# Altium project camera_module_V1R1.PrjPcb (part 1 of 2)
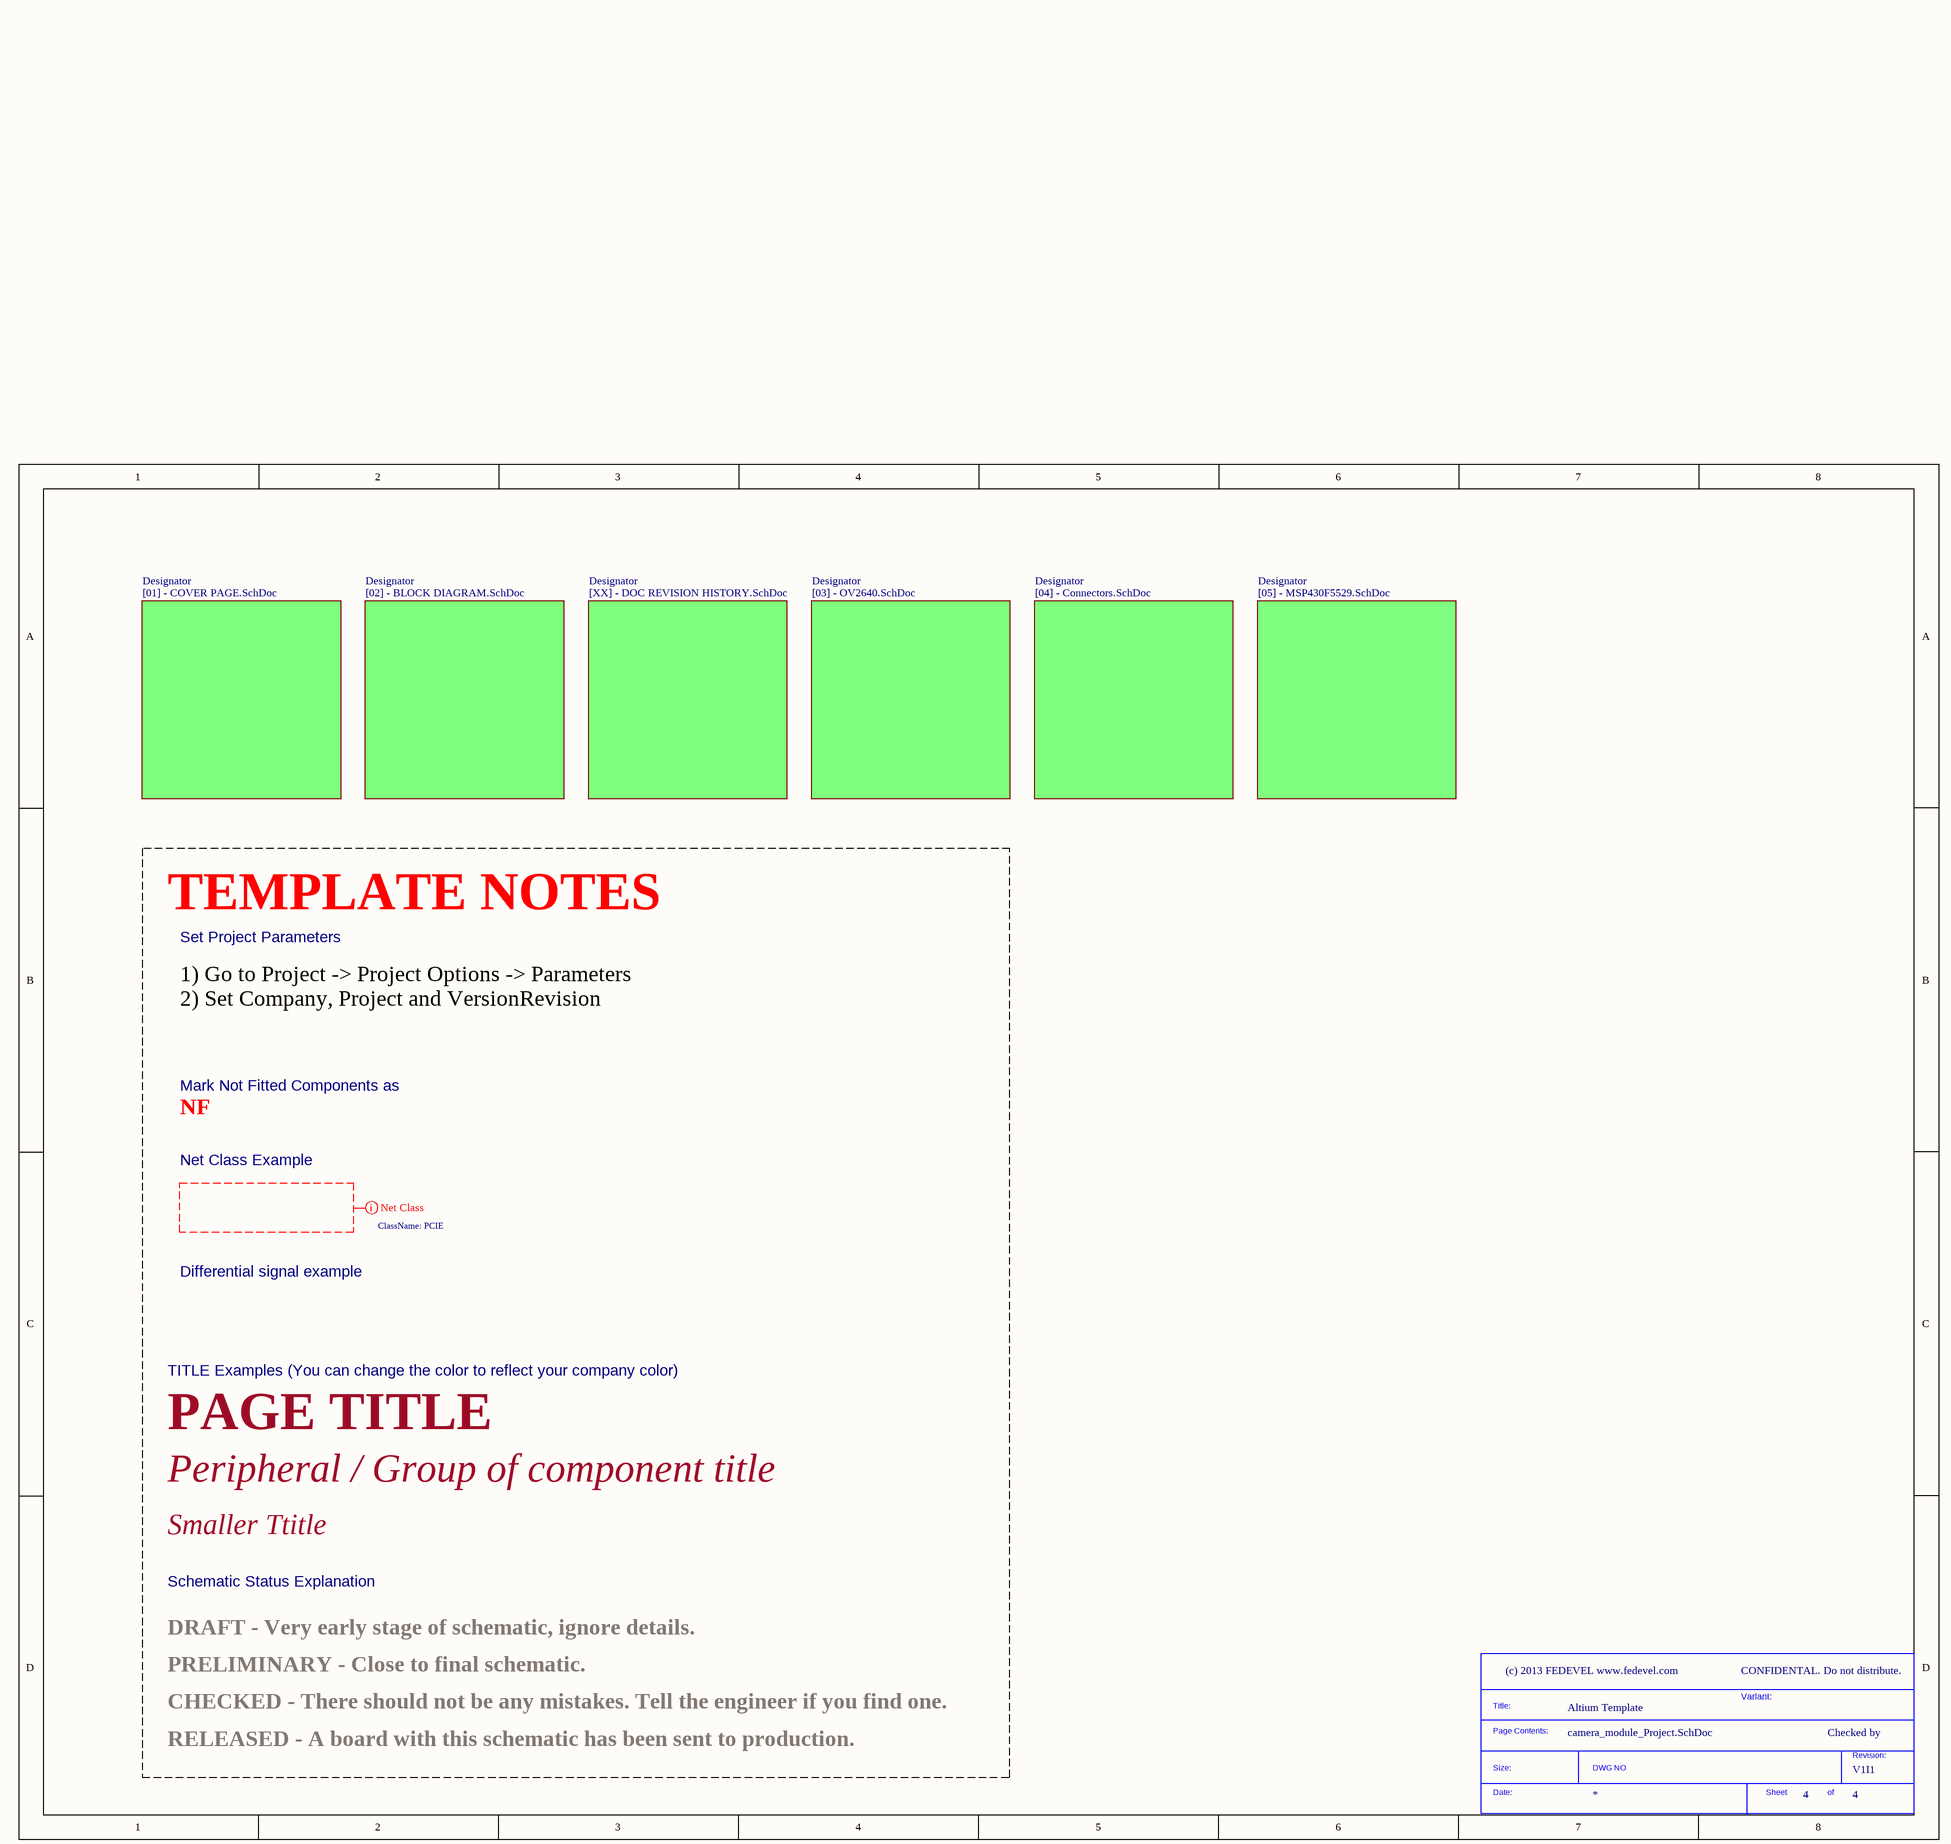
[diagram p0: camera_module_Project.SchDoc]
Company: (c) 2013 FEDEVEL www.fedevel.com; Project: Altium Template; VersionRevision: V1I1
5 sheets, 124 parts. Net scope: flat (ports and power ports of the same name join across sheets).
Board file: camera_module_PCB_V1R1.PcbDoc
Sheets:
  camera_module_Project.SchDoc
    Designator = [01] - COVER PAGE.SchDoc
    Designator = [03] - OV2640.SchDoc
    Designator = [04] - Connectors.SchDoc
    Designator = [05] - MSP430F5529.SchDoc

## Sheet camera_module_Project.SchDoc
size A3; CompanyName: KDS; Organization: KDS; DocumentNumber: 4; Revision: V1I1; SheetNumber: 4; SheetTotal: 4; PageSetup: Record=PageOptions|CenterHorizontal=True|CenterVertical=True|PrintScale=1.07|XCorrection=1.00|YCorrection=1.00|PrintKind=1|BorderSize=5000000|LeftOffset=0|BottomOffset=0|Orientation=2|PaperLength=1000|PaperWidth=1000|Scale=100|PaperSource=7|PrintQuality=600|MediaType=1|DitherType=10|PaperKind=A3|PrintScaleMode=1; ProjectName: KDS C6A816x Module

### Parts
(Parts that share a designator on the sheet are numbered #1, #2 ... from top to bottom, then left to right.)
*#1  SDTitleBlock  (value not drawn)  (graphical)

### Sub-sheets
Designator = [01] - COVER PAGE.SchDoc: no entries
Designator = [02] - BLOCK DIAGRAM.SchDoc (file not in this document): no entries
Designator = [XX] - DOC REVISION HISTORY.SchDoc (file not in this document): no entries
Designator = [03] - OV2640.SchDoc: no entries
Designator = [04] - Connectors.SchDoc: no entries
Designator = [05] - MSP430F5529.SchDoc: no entries

### Layout directives
net class PCIE: (no net found under the mark)

### Notes on the sheet
- TEMPLATE NOTES
- Set Project Parameters
- 1) Go to Project -> Project Options -> Parameters
  2) Set Company, Project and VersionRevision
- NF
- Mark Not Fitted Components as
- Net Class Example
- Differential signal example
- TITLE Examples (You can change the color to reflect your company color)
- PAGE TITLE
- Peripheral / Group of component title
- Smaller Ttitle
- Schematic Status Explanation
- PRELIMINARY - Close to final schematic.
- DRAFT - Very early stage of schematic, ignore details.
- CONFIDENTAL. Do not distribute.
- CHECKED - There should not be any mistakes. Tell the engineer if you find one.
- Variant:
- Checked by
- RELEASED - A board with this schematic has been sent to production.
- (in symbol SDTitleBlock) Title:; Page Contents:; Revision:; Size:; DWG NO; Date:; Sheet; of

## Sheet [01] - COVER PAGE.SchDoc
size A3; DocumentNumber: 1; SheetNumber: 1; SheetTotal: 4
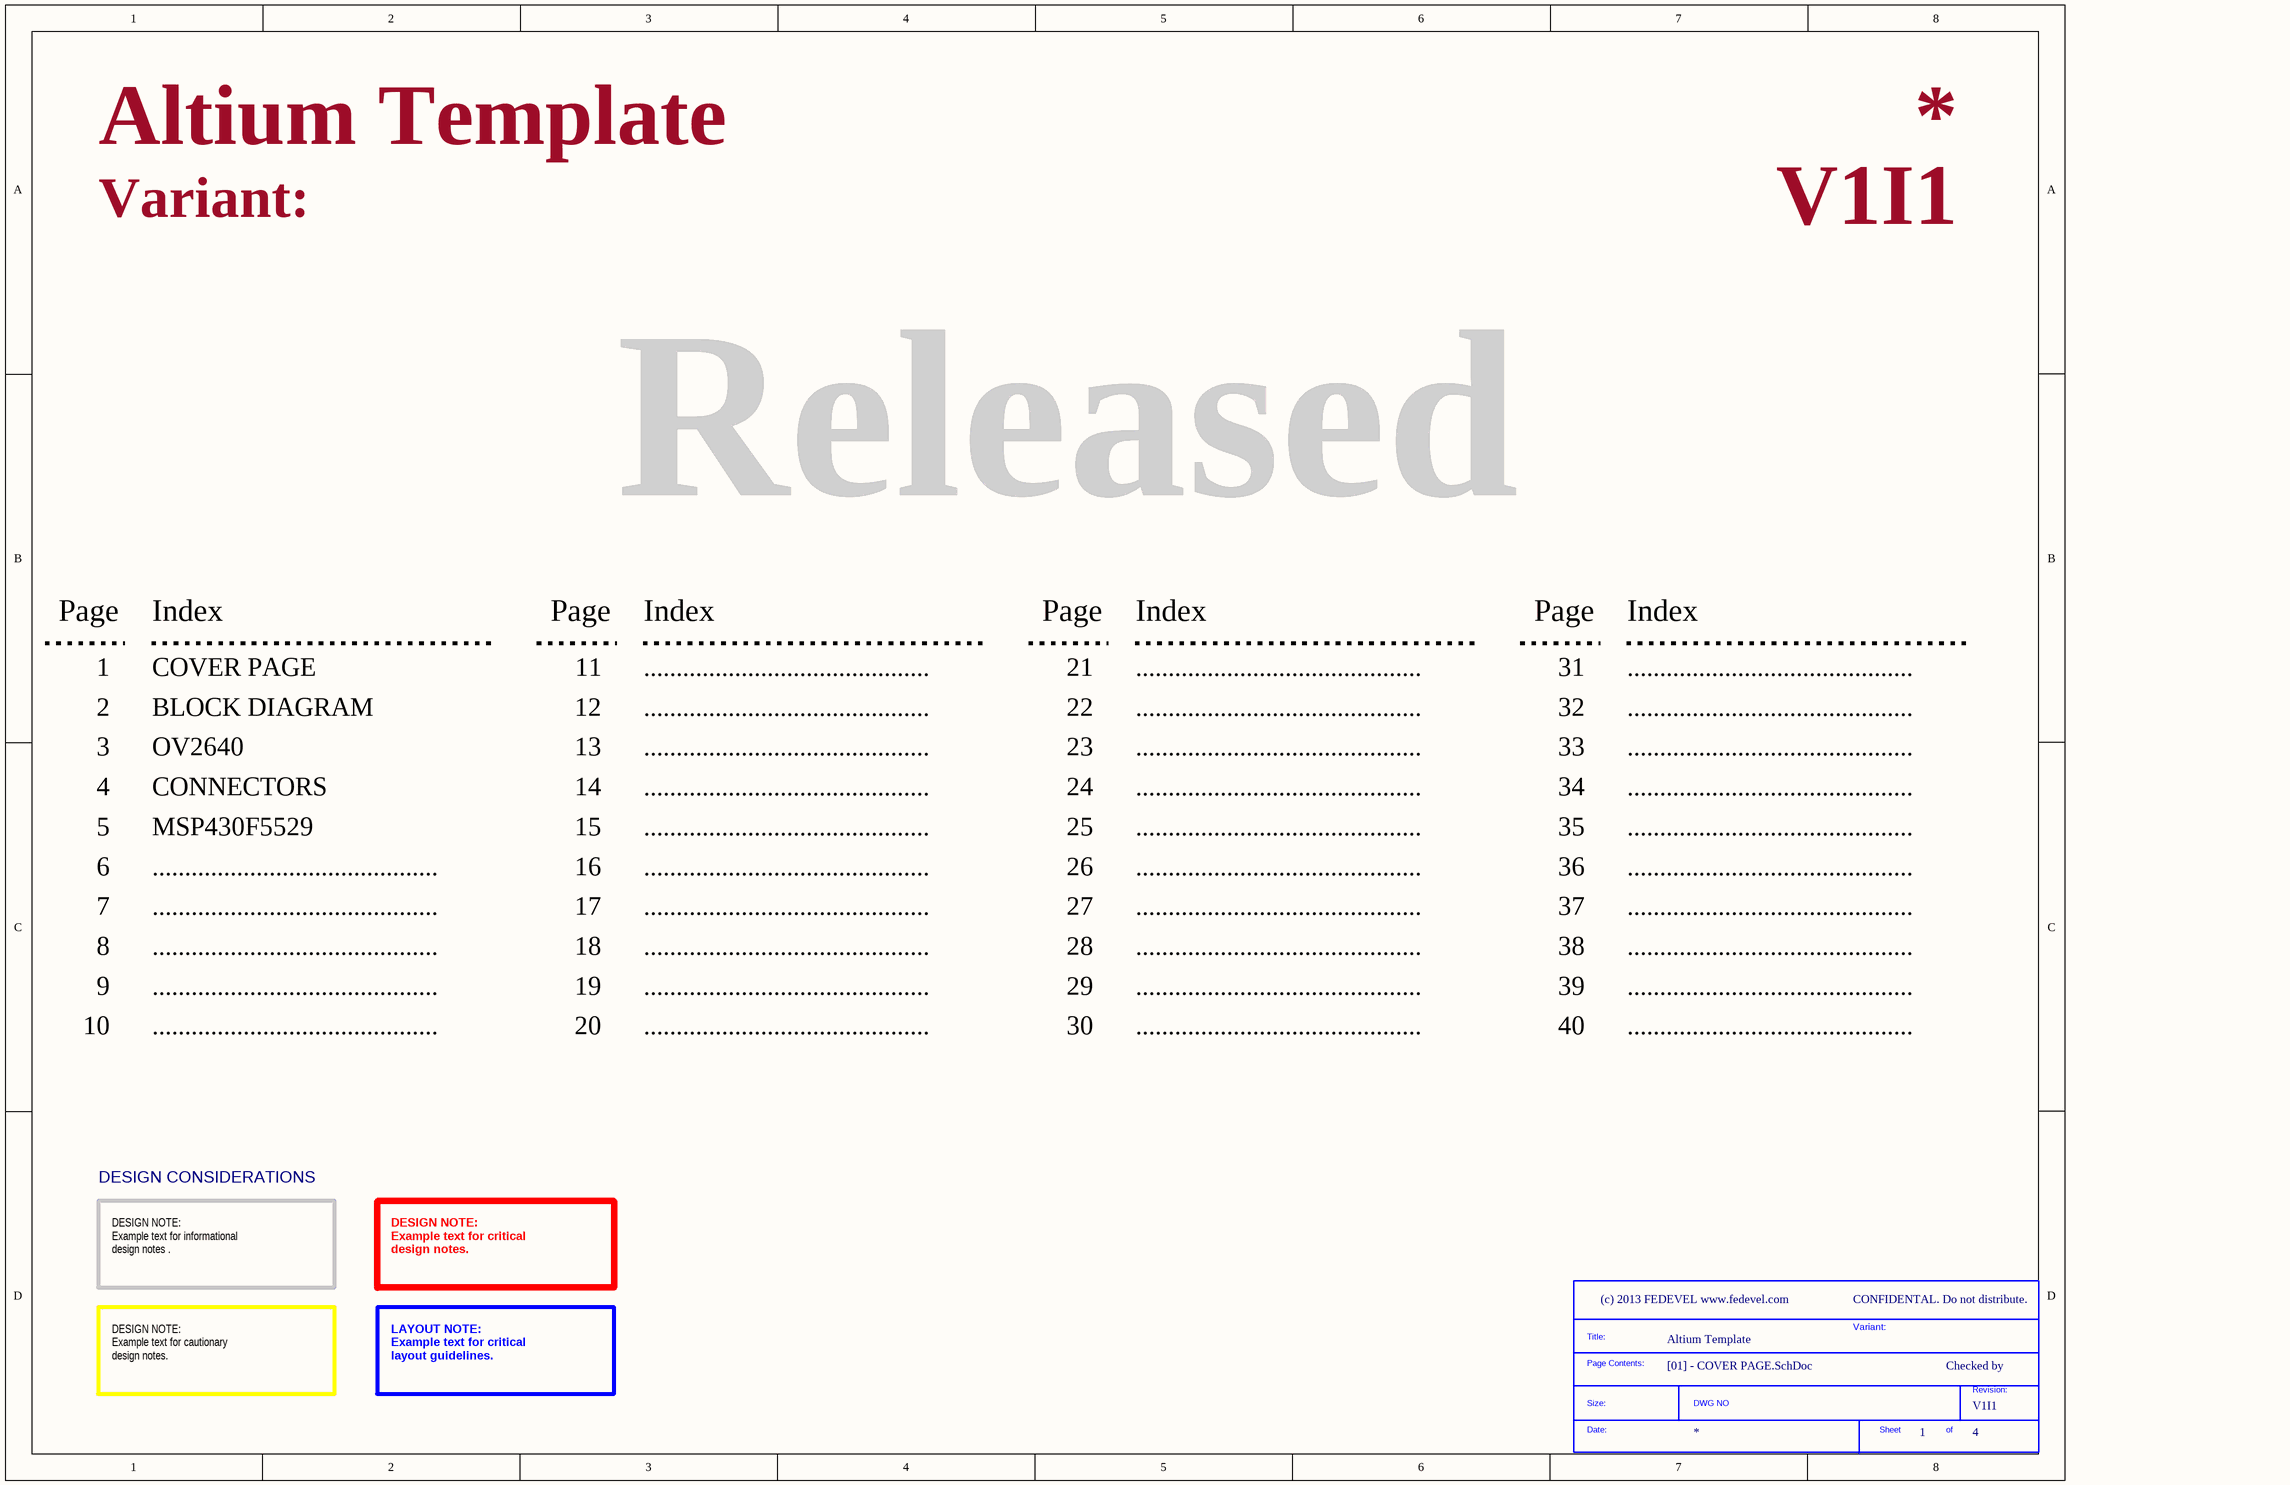
[diagram p1: [01] - COVER PAGE.SchDoc]

### Parts
(Parts that share a designator on the sheet are numbered #1, #2 ... from top to bottom, then left to right.)
*#2  SDTitleBlock  (value not drawn)  (graphical)

### Notes on the sheet
- Variant:
- Released
- Page
- Index
- 1
- COVER PAGE
- 11
- ............................................
- 21
- 31
- 2
- 3
- BLOCK DIAGRAM
- OV2640
- 12
- 13
- 22
- 23
- 32
- 33
- 4
- 5
- CONNECTORS
- MSP430F5529
- 14
- 15
- 24
- 25
- 34
- 35
- 6
- 16
- 26
- 36
- 7
- 8
- 17
- 18
- 27
- 28
- 37
- 38
- 9
- 10
- 19
- 20
- 29
- 30
- 39
- 40
- DESIGN CONSIDERATIONS
- DESIGN NOTE:
  Example text for informational
  design notes .
- DESIGN NOTE:
  Example text for critical
  design notes.
- CONFIDENTAL. Do not distribute.
- Checked by
- DESIGN NOTE:
  Example text for cautionary
  design notes.
- LAYOUT NOTE:
  Example text for critical
  layout guidelines.
- (in symbol SDTitleBlock) Title:; Page Contents:; Revision:; Size:; DWG NO; Date:; Sheet; of

## Sheet [03] - OV2640.SchDoc
size A3; DocumentNumber: 2; SheetNumber: 2; SheetTotal: 4
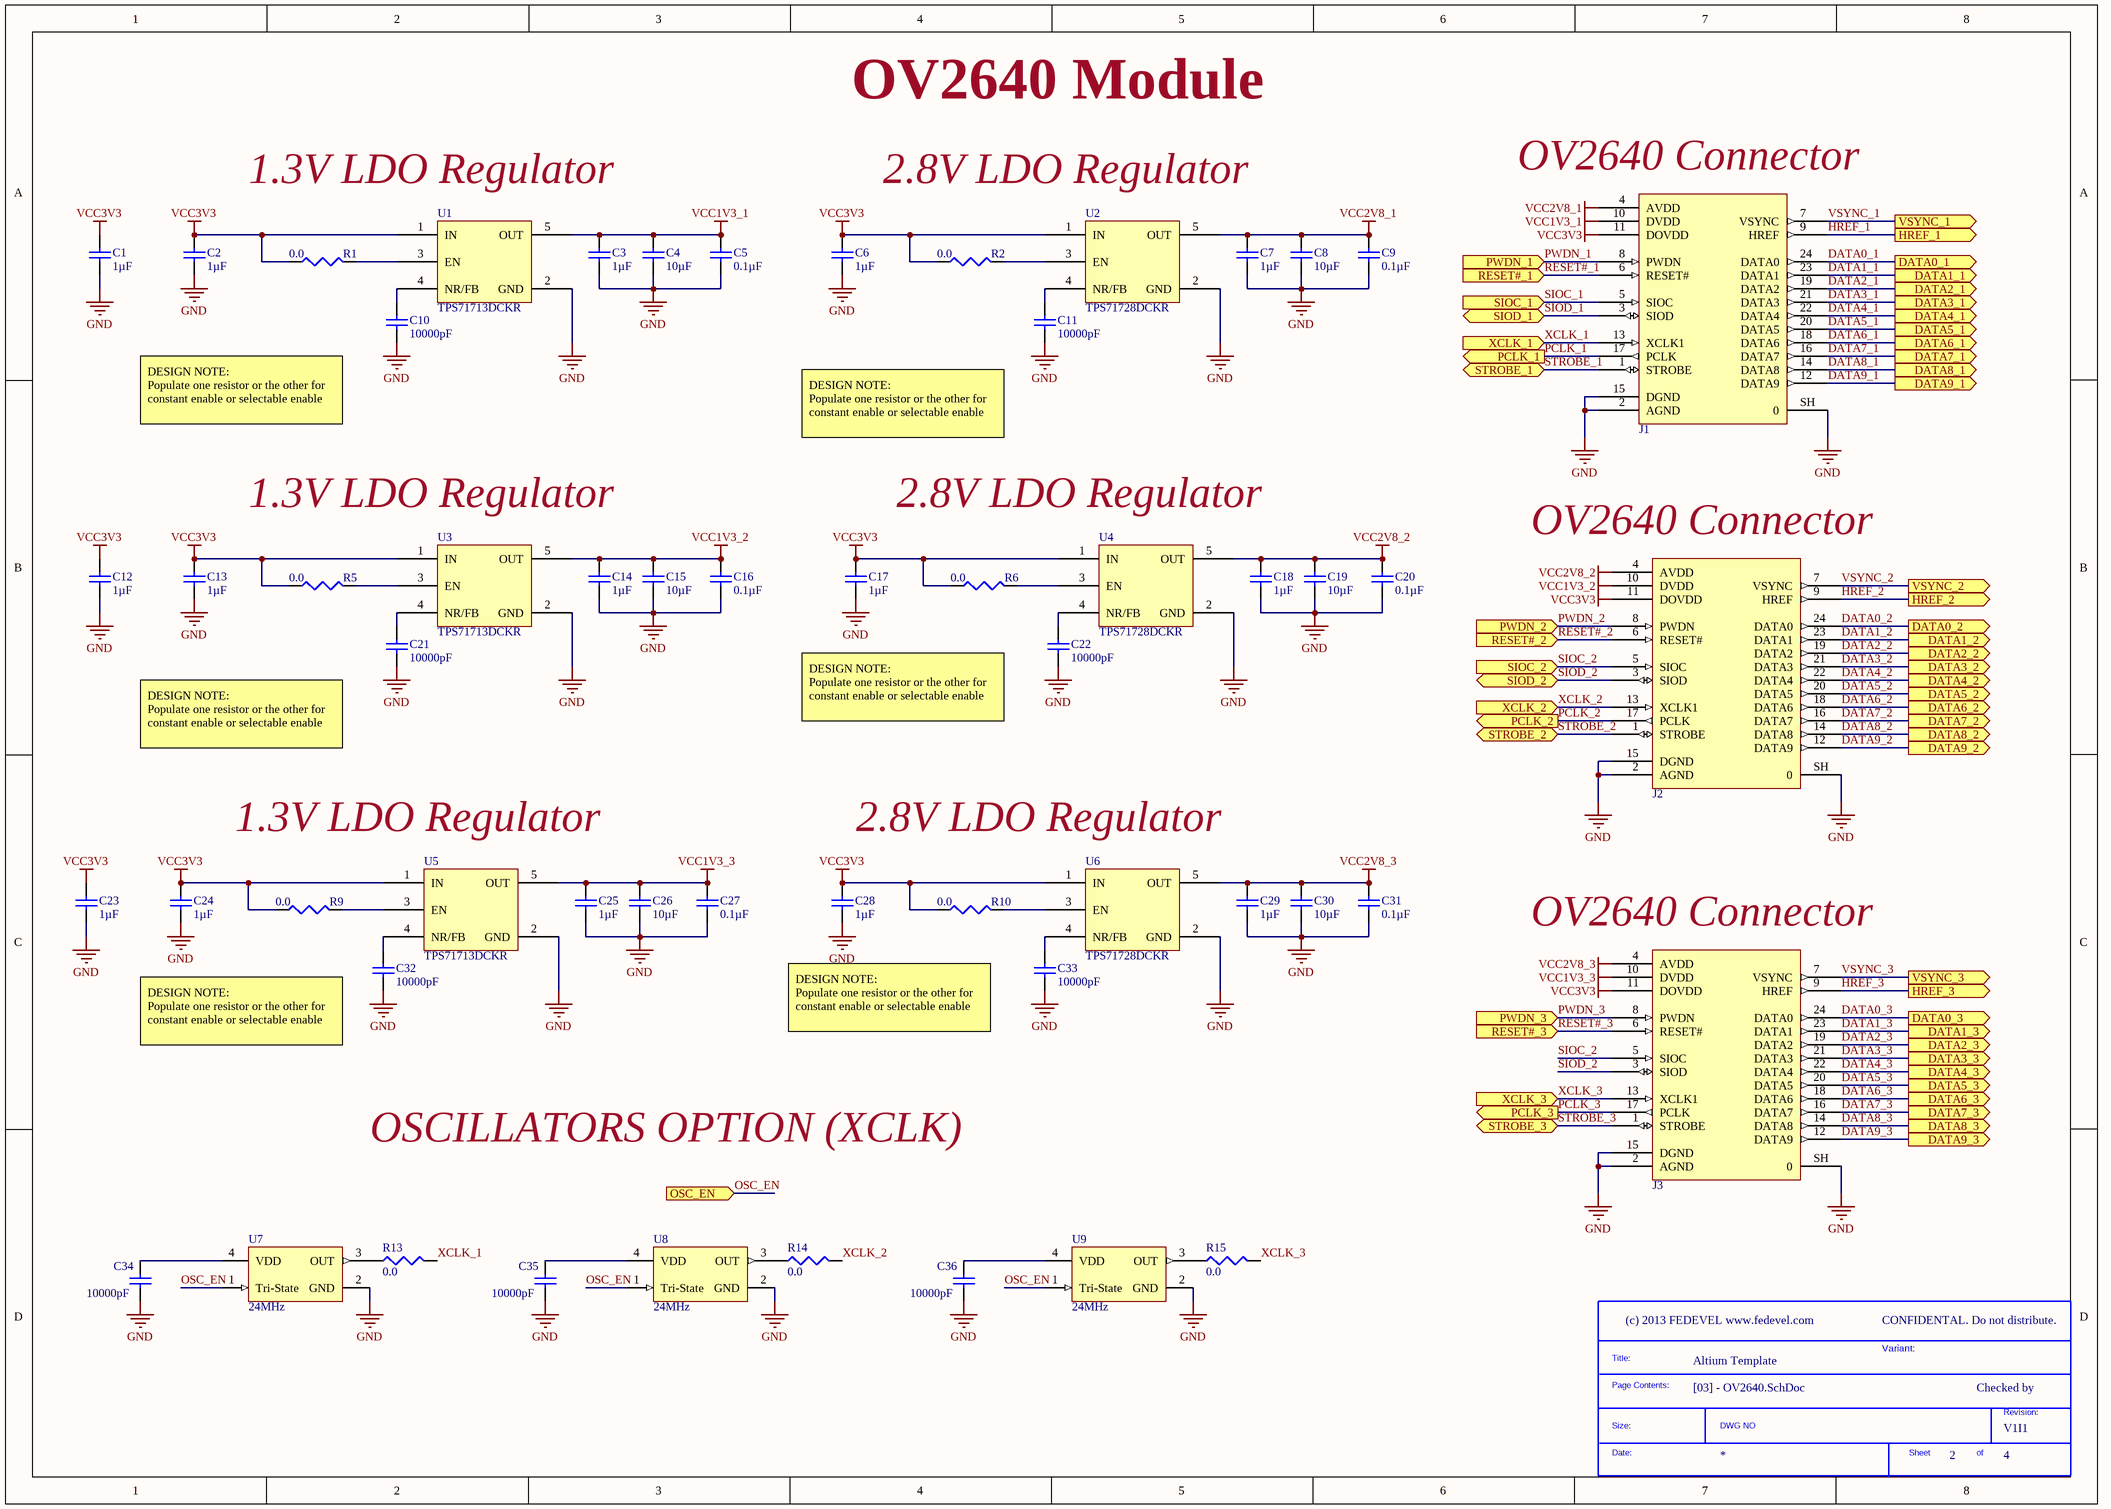
[diagram p2: [03] - OV2640.SchDoc]

### Parts
(Parts that share a designator on the sheet are numbered #1, #2 ... from top to bottom, then left to right.)
*#3  SDTitleBlock  (value not drawn)  (graphical)
C1  Capacitance: 1µF  [CAP-0603]  (hidden comment: GRM188R71C105KA12D)
C2  Capacitance: 1µF  [CAP-0603]  (hidden comment: GRM188R71C105KA12D)
C3  Capacitance: 1µF  [CAP-0603]  (hidden comment: GRM188R71C105KA12D)
C4  Capacitance: 10µF  [CAP-0805]  (hidden comment: GRM21BR61E106KA73L)
C5  Capacitance: 0.1µF  [CAP-0603]  (hidden comment: GRM188R71C104KA01D)
C6  Capacitance: 1µF  [CAP-0603]  (hidden comment: GRM188R71C105KA12D)
C7  Capacitance: 1µF  [CAP-0603]  (hidden comment: GRM188R71C105KA12D)
C8  Capacitance: 10µF  [CAP-0805]  (hidden comment: GRM21BR61E106KA73L)
C9  Capacitance: 0.1µF  [CAP-0603]  (hidden comment: GRM188R71C104KA01D)
C10  Capacitance: 10000pF  [CAP-0603]  (hidden comment: GRM188R71E103KA01D)
C11  Capacitance: 10000pF  [CAP-0603]  (hidden comment: GRM188R71E103KA01D)
C12  Capacitance: 1µF  [CAP-0603]  (hidden comment: GRM188R71C105KA12D)
C13  Capacitance: 1µF  [CAP-0603]  (hidden comment: GRM188R71C105KA12D)
C14  Capacitance: 1µF  [CAP-0603]  (hidden comment: GRM188R71C105KA12D)
C15  Capacitance: 10µF  [CAP-0805]  (hidden comment: GRM21BR61E106KA73L)
C16  Capacitance: 0.1µF  [CAP-0603]  (hidden comment: GRM188R71C104KA01D)
C17  Capacitance: 1µF  [CAP-0603]  (hidden comment: GRM188R71C105KA12D)
C18  Capacitance: 1µF  [CAP-0603]  (hidden comment: GRM188R71C105KA12D)
C19  Capacitance: 10µF  [CAP-0805]  (hidden comment: GRM21BR61E106KA73L)
C20  Capacitance: 0.1µF  [CAP-0603]  (hidden comment: GRM188R71C104KA01D)
C21  Capacitance: 10000pF  [CAP-0603]  (hidden comment: GRM188R71E103KA01D)
C22  Capacitance: 10000pF  [CAP-0603]  (hidden comment: GRM188R71E103KA01D)
C23  Capacitance: 1µF  [CAP-0603]  (hidden comment: GRM188R71C105KA12D)
C24  Capacitance: 1µF  [CAP-0603]  (hidden comment: GRM188R71C105KA12D)
C25  Capacitance: 1µF  [CAP-0603]  (hidden comment: GRM188R71C105KA12D)
C26  Capacitance: 10µF  [CAP-0805]  (hidden comment: GRM21BR61E106KA73L)
C27  Capacitance: 0.1µF  [CAP-0603]  (hidden comment: GRM188R71C104KA01D)
C28  Capacitance: 1µF  [CAP-0603]  (hidden comment: GRM188R71C105KA12D)
C29  Capacitance: 1µF  [CAP-0603]  (hidden comment: GRM188R71C105KA12D)
C30  Capacitance: 10µF  [CAP-0805]  (hidden comment: GRM21BR61E106KA73L)
C31  Capacitance: 0.1µF  [CAP-0603]  (hidden comment: GRM188R71C104KA01D)
C32  Capacitance: 10000pF  [CAP-0603]  (hidden comment: GRM188R71E103KA01D)
C33  Capacitance: 10000pF  [CAP-0603]  (hidden comment: GRM188R71E103KA01D)
C34  Capacitance: 10000pF  [CAP-0603]  (hidden comment: GRM188R71E103KA01D)
C35  Capacitance: 10000pF  [CAP-0603]  (hidden comment: GRM188R71E103KA01D)
C36  Capacitance: 10000pF  [CAP-0603]  (hidden comment: GRM188R71E103KA01D)
J1  OV2640 FFC  [ov2640FSL]  (value not drawn)
J2  OV2640 FFC  [ov2640FSL]  (value not drawn)
J3  OV2640 FFC  [ov2640FSL]  (value not drawn)
R1  Resistance (Ohms): 0.0  [R0603]  (hidden comment: ERJ-3GEY0R00V)
R2  Resistance (Ohms): 0.0  [R0603]  (hidden comment: ERJ-3GEY0R00V)
R5  Resistance (Ohms): 0.0  [R0603]  (hidden comment: ERJ-3GEY0R00V)
R6  Resistance (Ohms): 0.0  [R0603]  (hidden comment: ERJ-3GEY0R00V)
R9  Resistance (Ohms): 0.0  [R0603]  (hidden comment: ERJ-3GEY0R00V)
R10  Resistance (Ohms): 0.0  [R0603]  (hidden comment: ERJ-3GEY0R00V)
R13  Resistance (Ohms): 0.0  [R0603]  (hidden comment: ERJ-3GEY0R00V)
R14  Resistance (Ohms): 0.0  [R0603]  (hidden comment: ERJ-3GEY0R00V)
R15  Resistance (Ohms): 0.0  [R0603]  (hidden comment: ERJ-3GEY0R00V)
U1  TPS71713DCKR  [SOT65P210X110-5N]
U2  TPS71728DCKR  [SOT65P210X110-5N]
U3  TPS71713DCKR  [SOT65P210X110-5N]
U4  TPS71728DCKR  [SOT65P210X110-5N]
U5  TPS71713DCKR  [SOT65P210X110-5N]
U6  TPS71728DCKR  [SOT65P210X110-5N]
U7  24MHz  [OSC 4-SMD]
U8  24MHz  [OSC 4-SMD]
U9  24MHz  [OSC 4-SMD]

### Ports
DATA0_1 (out), DATA0_2 (out), DATA0_3 (out), DATA1_1 (out), DATA1_2 (out), DATA1_3 (out), DATA2_1 (out), DATA2_2 (out), DATA2_3 (out), DATA3_1 (out), DATA3_2 (out), DATA3_3 (out), DATA4_1 (out), DATA4_2 (out), DATA4_3 (out), DATA5_1 (out), DATA5_2 (out), DATA5_3 (out), DATA6_1 (out), DATA6_2 (out), DATA6_3 (out), DATA7_1 (out), DATA7_2 (out), DATA7_3 (out), DATA8_1 (out), DATA8_2 (out), DATA8_3 (out), DATA9_1 (out), DATA9_2 (out), DATA9_3 (out), HREF_1 (out), HREF_2 (out), HREF_3 (out), OSC_EN (in), PCLK_1 (out), PCLK_2 (out), PCLK_3 (out), PWDN_1 (in), PWDN_2 (in), PWDN_3 (in), RESET#_1 (in), RESET#_2 (in), RESET#_3 (in), SIOC_1 (in), SIOC_2 (in), SIOD_1 (bidir), SIOD_2 (bidir), STROBE_1 (bidir), STROBE_2 (bidir), STROBE_3 (bidir), VSYNC_1 (out), VSYNC_2 (out), VSYNC_3 (out), XCLK_1 (in), XCLK_2 (in), XCLK_3 (in)

### Nets
GND: C1.2 C2.2 C3.2 C4.2 C5.2 C6.2 C7.2 C8.2 C9.2 C10.2 C11.2 C12.2 C13.2 C14.2 C15.2 C16.2 C17.2 C18.2 C19.2 C20.2 C21.2 C22.2 C23.2 C24.2 C25.2 C26.2 C27.2 C28.2 C29.2 C30.2 C31.2 C32.2 C33.2 C34.2 C35.2 C36.2 J1.2(AGND) J1.15(DGND) J1.SH(0) J2.2(AGND) J2.15(DGND) J2.SH(0) J3.2(AGND) J3.15(DGND) J3.SH(0) U1.2(GND) U2.2(GND) U3.2(GND) U4.2(GND) U5.2(GND) U6.2(GND) U7.2(GND) U8.2(GND) U9.2(GND)
VCC1V3_1: C3.1 C4.1 C5.1 J1.10(DVDD) U1.5(OUT)
VCC1V3_2: C14.1 C15.1 C16.1 J2.10(DVDD) U3.5(OUT)
VCC1V3_3: C25.1 C26.1 C27.1 J3.10(DVDD) U5.5(OUT)
VCC2V8_1: C7.1 C8.1 C9.1 J1.4(AVDD) U2.5(OUT)
VCC2V8_2: C18.1 C19.1 C20.1 J2.4(AVDD) U4.5(OUT)
VCC2V8_3: C29.1 C30.1 C31.1 J3.4(AVDD) U6.5(OUT)
VCC3V3: C1.1 C2.1 C6.1 C12.1 C13.1 C17.1 C23.1 C24.1 C28.1 J1.11(DOVDD) J2.11(DOVDD) J3.11(DOVDD) R1.1 R2.1 R5.1 R6.1 R9.1 R10.1 U1.1(IN) U2.1(IN) U3.1(IN) U4.1(IN) U5.1(IN) U6.1(IN)
DATA0_1: J1.24(DATA0) ; port DATA0_1
DATA0_2: J2.24(DATA0) ; port DATA0_2
DATA0_3: J3.24(DATA0) ; port DATA0_3
DATA1_1: J1.23(DATA1) ; port DATA1_1
DATA1_2: J2.23(DATA1) ; port DATA1_2
DATA1_3: J3.23(DATA1) ; port DATA1_3
DATA2_1: J1.19(DATA2) ; port DATA2_1
DATA2_2: J2.19(DATA2) ; port DATA2_2
DATA2_3: J3.19(DATA2) ; port DATA2_3
DATA3_1: J1.21(DATA3) ; port DATA3_1
DATA3_2: J2.21(DATA3) ; port DATA3_2
DATA3_3: J3.21(DATA3) ; port DATA3_3
DATA4_1: J1.22(DATA4) ; port DATA4_1
DATA4_2: J2.22(DATA4) ; port DATA4_2
DATA4_3: J3.22(DATA4) ; port DATA4_3
DATA5_1: J1.20(DATA5) ; port DATA5_1
DATA5_2: J2.20(DATA5) ; port DATA5_2
DATA5_3: J3.20(DATA5) ; port DATA5_3
DATA6_1: J1.18(DATA6) ; port DATA6_1
DATA6_2: J2.18(DATA6) ; port DATA6_2
DATA6_3: J3.18(DATA6) ; port DATA6_3
DATA7_1: J1.16(DATA7) ; port DATA7_1
DATA7_2: J2.16(DATA7) ; port DATA7_2
DATA7_3: J3.16(DATA7) ; port DATA7_3
DATA8_1: J1.14(DATA8) ; port DATA8_1
DATA8_2: J2.14(DATA8) ; port DATA8_2
DATA8_3: J3.14(DATA8) ; port DATA8_3
DATA9_1: J1.12(DATA9) ; port DATA9_1
DATA9_2: J2.12(DATA9) ; port DATA9_2
DATA9_3: J3.12(DATA9) ; port DATA9_3
HREF_1: J1.9(HREF) ; port HREF_1
HREF_2: J2.9(HREF) ; port HREF_2
HREF_3: J3.9(HREF) ; port HREF_3
OSC_EN: U7.1(Tri-State) U8.1(Tri-State) U9.1(Tri-State) ; port OSC_EN
PCLK_1: J1.17(PCLK) ; port PCLK_1
PCLK_2: J2.17(PCLK) ; port PCLK_2
PCLK_3: J3.17(PCLK) ; port PCLK_3
PWDN_1: J1.8(PWDN) ; port PWDN_1
PWDN_2: J2.8(PWDN) ; port PWDN_2
PWDN_3: J3.8(PWDN) ; port PWDN_3
RESET#_1: J1.6(RESET#) ; port RESET#_1
RESET#_2: J2.6(RESET#) ; port RESET#_2
RESET#_3: J3.6(RESET#) ; port RESET#_3
SIOC_1: J1.5(SIOC) ; port SIOC_1
SIOC_2: J2.5(SIOC) J3.5(SIOC) ; port SIOC_2
SIOD_1: J1.3(SIOD) ; port SIOD_1
SIOD_2: J2.3(SIOD) J3.3(SIOD) ; port SIOD_2
STROBE_1: J1.1(STROBE) ; port STROBE_1
STROBE_2: J2.1(STROBE) ; port STROBE_2
STROBE_3: J3.1(STROBE) ; port STROBE_3
VSYNC_1: J1.7(VSYNC) ; port VSYNC_1
VSYNC_2: J2.7(VSYNC) ; port VSYNC_2
VSYNC_3: J3.7(VSYNC) ; port VSYNC_3
XCLK_1: J1.13(XCLK1) R13.2 ; port XCLK_1
XCLK_2: J2.13(XCLK1) R14.2 ; port XCLK_2
XCLK_3: J3.13(XCLK1) R15.2 ; port XCLK_3
NetC10_1: C10.1 U1.4(NR/FB)
NetC11_1: C11.1 U2.4(NR/FB)
NetC21_1: C21.1 U3.4(NR/FB)
NetC22_1: C22.1 U4.4(NR/FB)
NetC32_1: C32.1 U5.4(NR/FB)
NetC33_1: C33.1 U6.4(NR/FB)
NetC34_1: C34.1 U7.4(VDD)
NetC35_1: C35.1 U8.4(VDD)
NetC36_1: C36.1 U9.4(VDD)
NetR1_2: R1.2 U1.3(EN)
NetR2_2: R2.2 U2.3(EN)
NetR5_2: R5.2 U3.3(EN)
NetR6_2: R6.2 U4.3(EN)
NetR9_2: R9.2 U5.3(EN)
NetR10_2: R10.2 U6.3(EN)
NetR13_1: R13.1 U7.3(OUT)
NetR14_1: R14.1 U8.3(OUT)
NetR15_1: R15.1 U9.3(OUT)

### Notes on the sheet
- OV2640 Module
- (near J1) OV2640 Connector
- 1.3V LDO Regulator
- 2.8V LDO Regulator
- DESIGN NOTE:
  Populate one resistor or the other for constant enable or selectable enable
- (near J2) OV2640 Connector
- (near J3) OV2640 Connector
- (near C32) DESIGN NOTE:
  Populate one resistor or the other for constant enable or selectable enable
- OSCILLATORS OPTION (XCLK)
- CONFIDENTAL. Do not distribute.
- Variant:
- Checked by
- (in symbol SDTitleBlock) Title:; Page Contents:; Revision:; Size:; DWG NO; Date:; Sheet; of

### Library data of the parts
C1-C3 C6 C7 C12-C14 C17 C18 C23-C25 C28 C29 = GRM188R71C105KA12D: CAP CER 1UF 16V X7R 0603; Manufacturer: Murata Electronics North America; Tolerance: ±10%; Supplier 1: Digi-Key; Manufacturer Part Number: GRM188R71C105KA12D; RoHS: RoHS Compliant; Category: Capacitors; Stock 1: 819049; Pricing 1: 1=0.1, 10=0.073, 50=0.0396, 100=0.0336, 250=0.02744, 500=0.02348, 1000=0.0183 (USD); Packaging: Cut Tape (CT); Voltage - Rated: 16V; Temperature Coefficient: X7R; Mounting Type: Surface Mount, MLCC; Operating Temperature: -55°C ~ 125°C; Applications: General Purpose; Ratings: -; Package / Case: 0603 (1608 Metric); Size / Dimension: 0.063" L x 0.031" W (1.60mm x 0.80mm); Height - Seated (Max): -; Thickness (Max): 0.035" (0.90mm); Lead Spacing: -; Features: -; Lead Style: -; ComponentLink1URL: http://www.murata.com/~/media/webrenewal/support/library/catalog/products/capacitor/mlcc/c02e.pdf; ComponentLink1Description: http://www.murata.com/~/media/webrenewal/support/library/catalog/products/capacitor/mlcc/c02e.pdf; Supplier Part Number 1: 490-3900-1-ND
C4 C8 C15 C19 C26 C30 = GRM21BR61E106KA73L: CAP CER 10UF 25V X5R 0805; Manufacturer: Murata Electronics North America; Tolerance: ±10%; Supplier 1: Digi-Key; Manufacturer Part Number: GRM21BR61E106KA73L; RoHS: RoHS Compliant; Category: Capacitors; Stock 1: 242003; Pricing 1: 1=0.2, 10=0.136, 50=0.0826, 100=0.0693 (USD); Packaging: Cut Tape (CT); Voltage - Rated: 25V; Temperature Coefficient: X5R; Mounting Type: Surface Mount, MLCC; Operating Temperature: -55°C ~ 85°C; Applications: General Purpose; Ratings: -; Package / Case: 0805 (2012 Metric); Size / Dimension: 0.079" L x 0.049" W (2.00mm x 1.25mm); Height - Seated (Max): -; Thickness (Max): 0.053" (1.35mm); Lead Spacing: -; Features: -; Lead Style: -; ComponentLink1URL: http://www.murata.com/~/media/webrenewal/support/library/catalog/products/capacitor/mlcc/c02e.pdf; ComponentLink1Description: http://www.murata.com/~/media/webrenewal/support/library/catalog/products/capacitor/mlcc/c02e.pdf; Supplier Part Number 1: 490-5523-1-ND
C5 C9 C16 C20 C27 C31 = GRM188R71C104KA01D: CAP CER 0.1UF 16V X7R 0603; Manufacturer: Murata Electronics North America; Tolerance: ±10%; Supplier 1: Digi-Key; Manufacturer Part Number: GRM188R71C104KA01D; RoHS: RoHS Compliant; Category: Capacitors; Stock 1: 3229528; Pricing 1: 1=0.1, 10=0.019, 50=0.0102, 100=0.0086, 250=0.00704, 500=0.006, 1000=0.00468 (USD); Packaging: Cut Tape (CT); Voltage - Rated: 16V; Temperature Coefficient: X7R; Mounting Type: Surface Mount, MLCC; Operating Temperature: -55°C ~ 125°C; Applications: General Purpose; Ratings: -; Package / Case: 0603 (1608 Metric); Size / Dimension: 0.063" L x 0.031" W (1.60mm x 0.80mm); Height - Seated (Max): -; Thickness (Max): 0.035" (0.90mm); Lead Spacing: -; Features: -; Lead Style: -; ComponentLink1URL: http://www.murata.com/~/media/webrenewal/support/library/catalog/products/capacitor/mlcc/c02e.pdf; ComponentLink1Description: http://www.murata.com/~/media/webrenewal/support/library/catalog/products/capacitor/mlcc/c02e.pdf; Supplier Part Number 1: 490-1532-1-ND
C10 C11 C21 C22 C32-C36 = GRM188R71E103KA01D: CAP CER 10000PF 25V X7R 0603; Manufacturer: Murata Electronics North America; Tolerance: ±10%; Supplier 1: Digi-Key; Manufacturer Part Number: GRM188R71E103KA01D; RoHS: RoHS Compliant; Category: Capacitors; Stock 1: 164488; Pricing 1: 1=0.1, 10=0.023, 50=0.0124, 100=0.0105, 250=0.00856, 500=0.00732, 1000=0.0057 (USD); Packaging: Cut Tape (CT); Voltage - Rated: 25V; Temperature Coefficient: X7R; Mounting Type: Surface Mount, MLCC; Operating Temperature: -55°C ~ 125°C; Applications: General Purpose; Ratings: -; Package / Case: 0603 (1608 Metric); Size / Dimension: 0.063" L x 0.031" W (1.60mm x 0.80mm); Height - Seated (Max): -; Thickness (Max): 0.035" (0.90mm); Lead Spacing: -; Features: -; Lead Style: -; ComponentLink1URL: http://www.murata.com/~/media/webrenewal/support/library/catalog/products/capacitor/mlcc/c02e.pdf; ComponentLink1Description: http://www.murata.com/~/media/webrenewal/support/library/catalog/products/capacitor/mlcc/c02e.pdf; Supplier Part Number 1: 490-1520-1-ND
J1-J3 = 0524372433: CONN FFC BOTTOM 24POS 0.50MM R/A; Manufacturer: Molex, LLC; Flat Flex Type: FFC, FPC; Connector/Contact Type: Contacts, Bottom; Number of Positions: 24; Pitch: 0.020" (0.50mm); FFC, FCB Thickness: 0.30mm; Locking Feature: Slide Lock; Cable End Type: Straight, Tapered; Actuator Material: Polyphenylene Sulfide (PPS), Glass Filled; Voltage Rating: 50V; Material Flammability Rating: UL94 V-0; Current Rating: 0.5A; Supplier 1: Digi-Key; Manufacturer Part Number: 0524372433; RoHS: RoHS Compliant; Category: Connectors, Interconnects; Stock 1: 133; Pricing 1: 1=2.39, 10=2.164, 25=2.032, 50=1.9436, 100=1.8552, 250=1.67848, 500=1.54596 (USD); Packaging: Cut Tape (CT); Mounting Type: Surface Mount, Right Angle; Termination: Solder; Height Above Board: 0.079" (2.00mm); Contact Material: Phosphor Bronze; Contact Finish: Tin Bismuth; Housing Material: Polyamide (PA), Nylon, Glass Filled; Features: Solder Retention, Zero Insertion Force (ZIF); Operating Temperature: -40°C ~ 85°C; ComponentLink1URL: http://www.molex.com/pdm_docs/sd/524372433_sd.pdf; ComponentLink1Description: http://www.molex.com/pdm_docs/sd/524372433_sd.pdf; Supplier Part Number 1: WM10976CT-ND
R1 R2 R5 R6 R9 R10 R13-R15 = ERJ-3GEY0R00V: RES SMD 0.0OHM JUMPER 1/10W 0603; Manufacturer: Panasonic Electronic Components; Power (Watts): 0.1W, 1/10W; Supplier 1: Digi-Key; Manufacturer Part Number: ERJ-3GEY0R00V; RoHS: RoHS Compliant; Category: Resistors; Stock 1: 7608993; Pricing 1: 1=0.1, 50=0.0126, 100=0.0096, 250=0.00716, 500=0.00528, 1000=0.00352, 2500=0.00297 (USD); Packaging: Cut Tape (CT); Tolerance: Jumper; Composition: Thick Film; Features: Automotive AEC-Q200; Temperature Coefficient: -; Operating Temperature: -55°C ~ 155°C; Package / Case: 0603 (1608 Metric); Supplier Device Package: 0603; Size / Dimension: 0.063" L x 0.031" W (1.60mm x 0.80mm); Height: 0.022" (0.55mm); Number of Terminations: 2; ComponentLink1URL: http://industrial.panasonic.com/www-cgi/jvcr13pz.cgi?E+PZ+3+AOA0001+ERJ3GEY0R00V+7+WW; ComponentLink1Description: http://industrial.panasonic.com/www-cgi/jvcr13pz.cgi?E+PZ+3+AOA0001+ERJ3GEY0R00V+7+WW; Supplier Part Number 1: P0.0GCT-ND
U1 U3 U5 = TPS71713DCKR: IC REG LDO 1.3V 0.15A SC70-5; Manufacturer: Texas Instruments; Regulator Topology: Positive Fixed; Current - Output: 150mA; Number of Regulators: 1; Voltage - Input: 2.5 V ~ 6.5 V; Current - Limit (Min): 200mA; Supplier 1: Digi-Key; Manufacturer Part Number: TPS71713DCKR; RoHS: RoHS Compliant; Category: Integrated Circuits (ICs); Stock 1: 590; Pricing 1: 1=1.1, 10=0.985, 100=0.7679, 500=0.63504, 1000=0.405 (USD); Packaging: Cut Tape (CT); Voltage - Output: 1.3V; Voltage - Dropout (Typical): -; Operating Temperature: -40°C ~ 125°C; Mounting Type: Surface Mount; Package / Case: 5-TSSOP, SC-70-5, SOT-353; Supplier Device Package: SC-70-5; ComponentLink1URL: http://www.ti.com/lit/ds/symlink/tps717.pdf; ComponentLink1Description: http://www.ti.com/lit/ds/symlink/tps717.pdf; Supplier Part Number 1: 296-21350-1-ND
U2 U4 U6 = TPS71728DCKR: IC REG LDO 2.8V 0.15A SC70-5; Manufacturer: Texas Instruments; Regulator Topology: Positive Fixed; Current - Output: 150mA; Voltage - Dropout (Typical): 0.17V @ 150mA; Number of Regulators: 1; Voltage - Input: Up to 6.5V; Current - Limit (Min): 200mA; Supplier 1: Digi-Key; Manufacturer Part Number: TPS71728DCKR; RoHS: RoHS Compliant; Category: Integrated Circuits (ICs); Stock 1: 2440; Pricing 1: 1=1.1, 10=0.985, 100=0.7679, 500=0.63504, 1000=0.405 (USD); Packaging: Cut Tape (CT); Voltage - Output: 2.8V; Operating Temperature: -40°C ~ 125°C; Mounting Type: Surface Mount; Package / Case: 5-TSSOP, SC-70-5, SOT-353; Supplier Device Package: SC-70-5; ComponentLink1URL: http://www.ti.com/lit/ds/symlink/tps717.pdf; ComponentLink1Description: http://www.ti.com/lit/ds/symlink/tps717.pdf; Supplier Part Number 1: 296-19650-1-ND
U7-U9 = ASFL1-24.000MHZ-EC-T: OSC XO 24.000MHZ HCMOS TTL SMD; Manufacturer: Abracon LLC; Function: Tri-State (Output Enable); Output: HCMOS, TTL; Voltage - Supply: 3.3V; Frequency Stability: ±50ppm; Current - Supply (Max): 15mA; Current - Supply (Disable) (Max): 10µA; Supplier 1: Digi-Key; Manufacturer Part Number: ASFL1-24.000MHZ-EC-T; RoHS: RoHS Compliant; Category: Crystals and Oscillators; Stock 1: 5040; Pricing 1: 1=1.25, 10=1.198, 50=1.1714, 100=1.0017, 500=0.9752 (USD); Packaging: Cut Tape (CT); Type: XO (Standard); Frequency: 24MHz; Operating Temperature: -20°C ~ 70°C; Ratings: -; Mounting Type: Surface Mount; Size / Dimension: 0.197" L x 0.126" W (5.00mm x 3.20mm); Height: 0.051" (1.30mm); Package / Case: 4-SMD, No Lead (DFN, LCC); ComponentLink1URL: http://www.abracon.com/Oscillators/ASFL1.pdf; ComponentLink1Description: http://www.abracon.com/Oscillators/ASFL1.pdf; Supplier Part Number 1: 300-8252-1-ND

## Sheet [04] - Connectors.SchDoc
size A3; DocumentNumber: 2; SheetNumber: 2; SheetTotal: 4
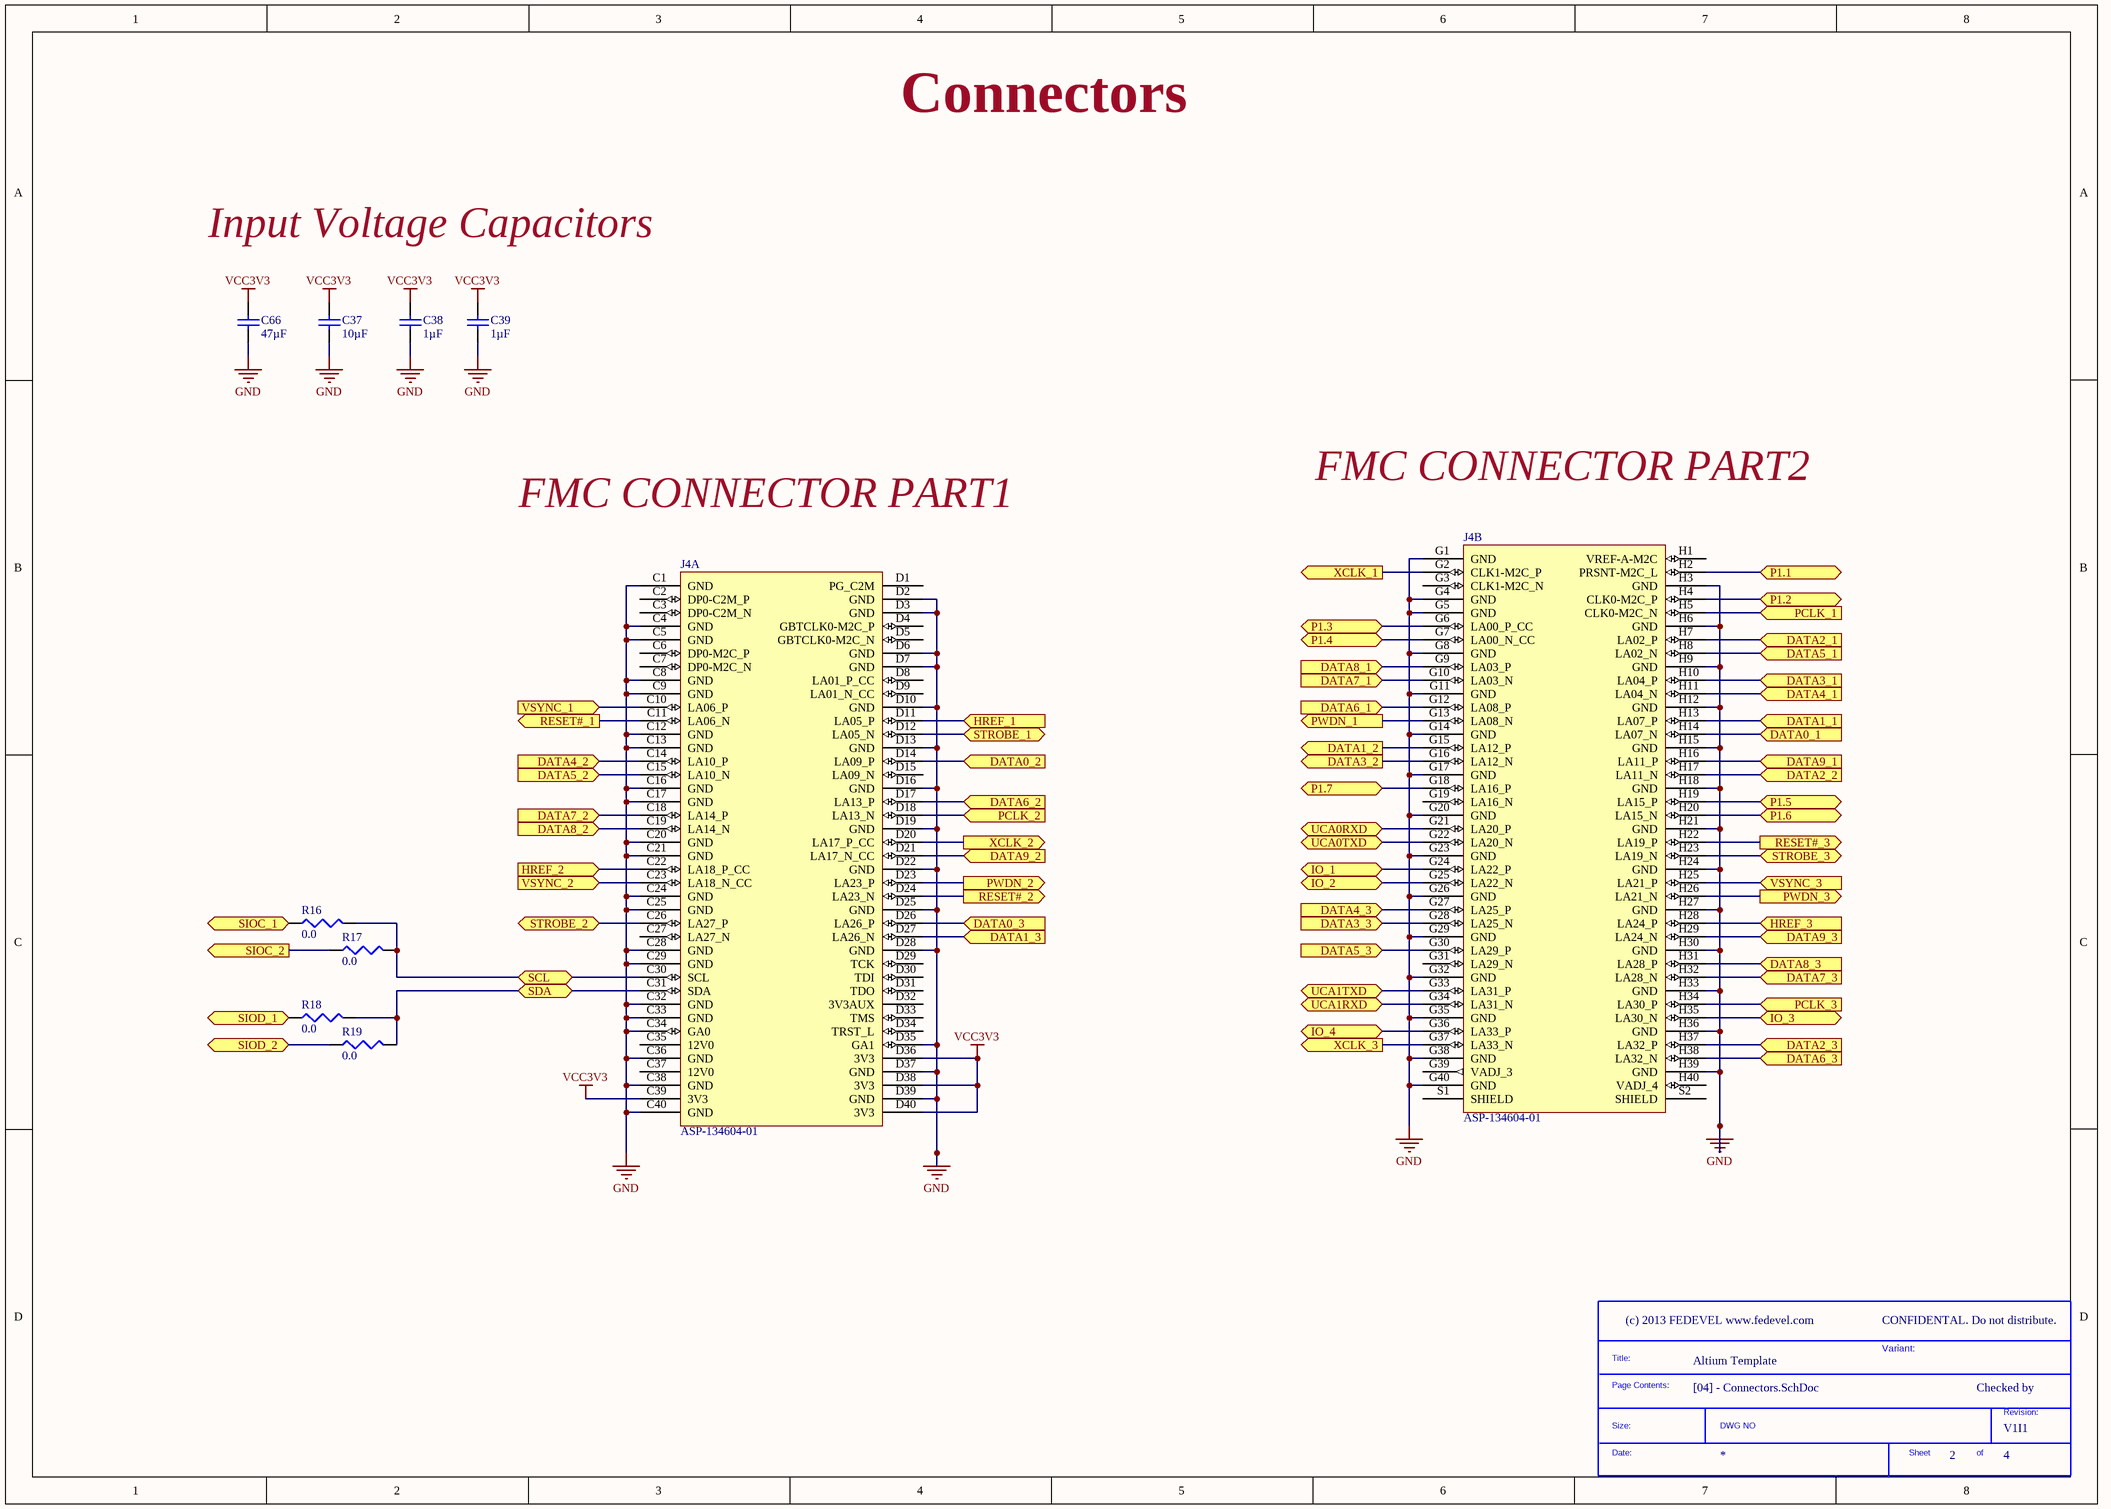
[diagram p3: [04] - Connectors.SchDoc]

### Parts
(Parts that share a designator on the sheet are numbered #1, #2 ... from top to bottom, then left to right.)
*#4  SDTitleBlock  (value not drawn)  (graphical)
C37  Capacitance: 10µF  [CAP-0805]  (hidden comment: GRM21BR61E106KA73L)
C38  Capacitance: 1µF  [CAP-0603]  (hidden comment: GRM188R71C105KA12D)
C39  Capacitance: 1µF  [CAP-0603]  (hidden comment: GRM188R71C105KA12D)
C66  Capacitance: 47µF  [CAP-0805]  (hidden comment: GRM21BR60J476ME15L)
J4  ASP-134604-01  [ASP-134604-01]  (parts A,B of 2)
R16  Resistance (Ohms): 0.0  [R0603]  (hidden comment: ERJ-3GEY0R00V)
R17  Resistance (Ohms): 0.0  [R0603]  (hidden comment: ERJ-3GEY0R00V)
R18  Resistance (Ohms): 0.0  [R0603]  (hidden comment: ERJ-3GEY0R00V)
R19  Resistance (Ohms): 0.0  [R0603]  (hidden comment: ERJ-3GEY0R00V)

### Ports
DATA0_1 (in), DATA0_2 (in), DATA0_3 (in), DATA1_1 (in), DATA1_2 (out), DATA1_3 (in), DATA2_1 (in), DATA2_2 (in), DATA2_3 (in), DATA3_1 (in), DATA3_2 (out), DATA3_3 (in), DATA4_1 (in), DATA4_2 (in), DATA4_3 (in), DATA5_1 (in), DATA5_2 (in), DATA5_3 (in), DATA6_1 (in), DATA6_2 (in), DATA6_3 (in), DATA7_1 (in), DATA7_2 (in), DATA7_3 (in), DATA8_1 (in), DATA8_2 (in), DATA8_3 (in), DATA9_1 (in), DATA9_2 (in), DATA9_3 (in), HREF_1 (in), HREF_2 (in), HREF_3 (in), IO_1 (bidir), IO_2 (bidir), IO_3 (bidir), IO_4 (bidir), P1.1 (bidir), P1.2 (bidir), P1.3 (bidir), P1.4 (bidir), P1.5 (bidir), P1.6 (bidir), P1.7 (bidir), PCLK_1 (in), PCLK_2 (in), PCLK_3 (in), PWDN_1 (out), PWDN_2 (out), PWDN_3 (out), RESET#_1 (out), RESET#_2 (out), RESET#_3 (out), SCL (bidir), SDA (bidir), SIOC_1 (out), SIOC_2 (out), SIOD_1 (bidir), SIOD_2 (bidir), STROBE_1 (bidir), STROBE_2 (bidir), STROBE_3 (bidir), UCA0RXD (bidir), UCA0TXD (bidir), UCA1RXD (bidir), UCA1TXD (bidir), VSYNC_1 (in), VSYNC_2 (in), VSYNC_3 (in), XCLK_1 (out), XCLK_2 (out), XCLK_3 (out)

### Nets
GND: C37.2 C38.2 C39.2 C66.2 J4.C1(GND) J4.C4(GND) J4.C5(GND) J4.C8(GND) J4.C9(GND) J4.C12(GND) J4.C13(GND) J4.C16(GND) J4.C17(GND) J4.C20(GND) J4.C21(GND) J4.C24(GND) J4.C25(GND) J4.C28(GND) J4.C29(GND) J4.C32(GND) J4.C33(GND) J4.C34(GA0) J4.C36(GND) J4.C38(GND) J4.C40(GND) J4.D2(GND) J4.D3(GND) J4.D6(GND) J4.D7(GND) J4.D10(GND) J4.D13(GND) J4.D16(GND) J4.D19(GND) J4.D22(GND) J4.D25(GND) J4.D28(GND) J4.D35(GA1) J4.D37(GND) J4.D39(GND) J4.G1(GND) J4.G4(GND) J4.G5(GND) J4.G8(GND) J4.G11(GND) J4.G14(GND) J4.G17(GND) J4.G20(GND) J4.G23(GND) J4.G26(GND) J4.G29(GND) J4.G32(GND) J4.G35(GND) J4.G38(GND) J4.G40(GND) J4.H3(GND) J4.H6(GND) J4.H9(GND) J4.H12(GND) J4.H15(GND) J4.H18(GND) J4.H21(GND) J4.H24(GND) J4.H27(GND) J4.H30(GND) J4.H33(GND) J4.H36(GND) J4.H39(GND)
VCC3V3: C37.1 C38.1 C39.1 C66.1 J4.C39(3V3) J4.D36(3V3) J4.D38(3V3) J4.D40(3V3)
DATA0_1: J4.H14(LA07_N) ; port DATA0_1
DATA0_2: J4.D14(LA09_P) ; port DATA0_2
DATA0_3: J4.D26(LA26_P) ; port DATA0_3
DATA1_1: J4.H13(LA07_P) ; port DATA1_1
DATA1_2: J4.G15(LA12_P) ; port DATA1_2
DATA1_3: J4.D27(LA26_N) ; port DATA1_3
DATA2_1: J4.H7(LA02_P) ; port DATA2_1
DATA2_2: J4.H17(LA11_N) ; port DATA2_2
DATA2_3: J4.H37(LA32_P) ; port DATA2_3
DATA3_1: J4.H10(LA04_P) ; port DATA3_1
DATA3_2: J4.G16(LA12_N) ; port DATA3_2
DATA3_3: J4.G28(LA25_N) ; port DATA3_3
DATA4_1: J4.H11(LA04_N) ; port DATA4_1
DATA4_2: J4.C14(LA10_P) ; port DATA4_2
DATA4_3: J4.G27(LA25_P) ; port DATA4_3
DATA5_1: J4.H8(LA02_N) ; port DATA5_1
DATA5_2: J4.C15(LA10_N) ; port DATA5_2
DATA5_3: J4.G30(LA29_P) ; port DATA5_3
DATA6_1: J4.G12(LA08_P) ; port DATA6_1
DATA6_2: J4.D17(LA13_P) ; port DATA6_2
DATA6_3: J4.H38(LA32_N) ; port DATA6_3
DATA7_1: J4.G10(LA03_N) ; port DATA7_1
DATA7_2: J4.C18(LA14_P) ; port DATA7_2
DATA7_3: J4.H32(LA28_N) ; port DATA7_3
DATA8_1: J4.G9(LA03_P) ; port DATA8_1
DATA8_2: J4.C19(LA14_N) ; port DATA8_2
DATA8_3: J4.H31(LA28_P) ; port DATA8_3
DATA9_1: J4.H16(LA11_P) ; port DATA9_1
DATA9_2: J4.D21(LA17_N_CC) ; port DATA9_2
DATA9_3: J4.H29(LA24_N) ; port DATA9_3
HREF_1: J4.D11(LA05_P) ; port HREF_1
HREF_2: J4.C22(LA18_P_CC) ; port HREF_2
HREF_3: J4.H28(LA24_P) ; port HREF_3
P1.1: J4.H2(PRSNT-M2C_L) ; port P1.1
P1.2: J4.H4(CLK0-M2C_P) ; port P1.2
P1.3: J4.G6(LA00_P_CC) ; port P1.3
P1.4: J4.G7(LA00_N_CC) ; port P1.4
P1.5: J4.H19(LA15_P) ; port P1.5
P1.6: J4.H20(LA15_N) ; port P1.6
P1.7: J4.G18(LA16_P) ; port P1.7
PCLK_1: J4.H5(CLK0-M2C_N) ; port PCLK_1
PCLK_2: J4.D18(LA13_N) ; port PCLK_2
PCLK_3: J4.H34(LA30_P) ; port PCLK_3
PWDN_1: J4.G13(LA08_N) ; port PWDN_1
PWDN_2: J4.D23(LA23_P) ; port PWDN_2
PWDN_3: J4.H26(LA21_N) ; port PWDN_3
RESET#_1: J4.C11(LA06_N) ; port RESET#_1
RESET#_2: J4.D24(LA23_N) ; port RESET#_2
RESET#_3: J4.H22(LA19_P) ; port RESET#_3
SIOC_1: R16.1 ; port SIOC_1
SIOC_2: R17.1 ; port SIOC_2
SIOD_1: R18.1 ; port SIOD_1
SIOD_2: R19.1 ; port SIOD_2
STROBE_1: J4.D12(LA05_N) ; port STROBE_1
STROBE_2: J4.C26(LA27_P) ; port STROBE_2
STROBE_3: J4.H23(LA19_N) ; port STROBE_3
UCA0RXD: J4.G21(LA20_P) ; port UCA0RXD
UCA0TXD: J4.G22(LA20_N) ; port UCA0TXD
UCA1RXD: J4.G34(LA31_N) ; port UCA1RXD
UCA1TXD: J4.G33(LA31_P) ; port UCA1TXD
VSYNC_1: J4.C10(LA06_P) ; port VSYNC_1
VSYNC_2: J4.C23(LA18_N_CC) ; port VSYNC_2
VSYNC_3: J4.H25(LA21_P) ; port VSYNC_3
XCLK_1: J4.G2(CLK1-M2C_P) ; port XCLK_1
XCLK_2: J4.D20(LA17_P_CC) ; port XCLK_2
XCLK_3: J4.G37(LA33_N) ; port XCLK_3
NetJ4_C30: J4.C30(SCL) R16.2 R17.2 ; port SCL
NetJ4_C31: J4.C31(SDA) R18.2 R19.2 ; port SDA
NetJ4_G24: J4.G24(LA22_P) ; port IO_1
NetJ4_G25: J4.G25(LA22_N) ; port IO_2
NetJ4_G36: J4.G36(LA33_P) ; port IO_4
NetJ4_H35: J4.H35(LA30_N) ; port IO_3

Not connected (* = marked no-connect by the designer): J4 C2(DP0-C2M_P) C3(DP0-C2M_N) C6(DP0-M2C_P) C7(DP0-M2C_N) C27(LA27_N) C35(12V0) C37(12V0) D1(PG_C2M) D4(GBTCLK0-M2C_P) D5(GBTCLK0-M2C_N) D8(LA01_P_CC) D9(LA01_N_CC) D15(LA09_N) D29(TCK) D30(TDI) D31(TDO) D32(3V3AUX) D33(TMS) D34(TRST_L) G3(CLK1-M2C_N) G19(LA16_N) G31(LA29_N) G39(VADJ_3) H1(VREF-A-M2C) H40(VADJ_4) S1(SHIELD) S2(SHIELD)

### Notes on the sheet
- Connectors
- Input Voltage Capacitors
- FMC CONNECTOR PART1
- FMC CONNECTOR PART2
- CONFIDENTAL. Do not distribute.
- Variant:
- Checked by
- (in symbol SDTitleBlock) Title:; Page Contents:; Revision:; Size:; DWG NO; Date:; Sheet; of

### Library data of the parts
C37 = GRM21BR61E106KA73L: as C4 on sheet [03] - OV2640; Supplier 1: Digi-Key; Manufacturer Part Number: GRM21BR61E106KA73L; RoHS: RoHS Compliant; Category: Capacitors; Stock 1: 242003; Pricing 1: 1=0.2, 10=0.136, 50=0.0826, 100=0.0693 (USD); Packaging: Cut Tape (CT); Voltage - Rated: 25V; Temperature Coefficient: X5R; Mounting Type: Surface Mount, MLCC; Operating Temperature: -55°C ~ 85°C; Applications: General Purpose; Ratings: -; Package / Case: 0805 (2012 Metric); Size / Dimension: 0.079" L x 0.049" W (2.00mm x 1.25mm); Height - Seated (Max): -; Thickness (Max): 0.053" (1.35mm); Lead Spacing: -; Features: -; Lead Style: -; ComponentLink1URL: http://www.murata.com/~/media/webrenewal/support/library/catalog/products/capacitor/mlcc/c02e.pdf; ComponentLink1Description: http://www.murata.com/~/media/webrenewal/support/library/catalog/products/capacitor/mlcc/c02e.pdf; Supplier Part Number 1: 490-5523-1-ND
C38 C39 = GRM188R71C105KA12D: as C1 on sheet [03] - OV2640; Supplier 1: Digi-Key; Manufacturer Part Number: GRM188R71C105KA12D; RoHS: RoHS Compliant; Category: Capacitors; Stock 1: 819049; Pricing 1: 1=0.1, 10=0.073, 50=0.0396, 100=0.0336, 250=0.02744, 500=0.02348, 1000=0.0183 (USD); Packaging: Cut Tape (CT); Voltage - Rated: 16V; Temperature Coefficient: X7R; Mounting Type: Surface Mount, MLCC; Operating Temperature: -55°C ~ 125°C; Applications: General Purpose; Ratings: -; Package / Case: 0603 (1608 Metric); Size / Dimension: 0.063" L x 0.031" W (1.60mm x 0.80mm); Height - Seated (Max): -; Thickness (Max): 0.035" (0.90mm); Lead Spacing: -; Features: -; Lead Style: -; ComponentLink1URL: http://www.murata.com/~/media/webrenewal/support/library/catalog/products/capacitor/mlcc/c02e.pdf; ComponentLink1Description: http://www.murata.com/~/media/webrenewal/support/library/catalog/products/capacitor/mlcc/c02e.pdf; Supplier Part Number 1: 490-3900-1-ND
C66 = GRM21BR60J476ME15L: CAP CER 47UF 6.3V X5R 0805; Manufacturer: Murata Electronics North America; Tolerance: ±20%; Supplier 1: Digi-Key; Manufacturer Part Number: GRM21BR60J476ME15L; RoHS: RoHS Compliant; Category: Capacitors; Stock 1: 2019; Pricing 1: 1=0.5, 10=0.48, 50=0.2864, 100=0.2327, 250=0.19332, 500=0.17542, 1000=0.1611 (USD); Packaging: Cut Tape (CT); Voltage - Rated: 6.3V; Temperature Coefficient: X5R; Mounting Type: Surface Mount, MLCC; Operating Temperature: -55°C ~ 85°C; Applications: General Purpose; Ratings: -; Package / Case: 0805 (2012 Metric); Size / Dimension: 0.079" L x 0.049" W (2.00mm x 1.25mm); Height - Seated (Max): -; Thickness (Max): 0.057" (1.45mm); Lead Spacing: -; Features: Derating Recommended; Lead Style: -; ComponentLink1URL: http://www.murata.com/~/media/webrenewal/support/library/catalog/products/capacitor/mlcc/c02e.pdf; ComponentLink1Description: http://www.murata.com/~/media/webrenewal/support/library/catalog/products/capacitor/mlcc/c02e.pdf; Supplier Part Number 1: 490-9960-1-ND
J4 = ASP-134604-01: SAMTEC - ASP-134604-01 - Board-To-Board Connector, Vita 57 XMC, ASP Series, Surface Mount, Header, 160, 1.27 mm; Supplier 1: Newark; Manufacturer: SAMTEC; Manufacturer Part Number: ASP-134604-01; RoHS: YES; Stock 1: 636; Pricing 1: 1=16.5, 10=15.6, 50=14.28, 100=12.96, 250=12.3, 500=11.72, 1000=11.55 (USD); ComponentLink1URL: http://www.farnell.com/cad/1838626.pdf; ComponentLink1Description: http://www.farnell.com/cad/1838626.pdf; Supplier Part Number 1: 79X1317
R16-R19 = ERJ-3GEY0R00V: as R1 on sheet [03] - OV2640; Supplier 1: Digi-Key; Manufacturer Part Number: ERJ-3GEY0R00V; RoHS: RoHS Compliant; Category: Resistors; Stock 1: 7608993; Pricing 1: 1=0.1, 50=0.0126, 100=0.0096, 250=0.00716, 500=0.00528, 1000=0.00352, 2500=0.00297 (USD); Packaging: Cut Tape (CT); Tolerance: Jumper; Composition: Thick Film; Features: Automotive AEC-Q200; Temperature Coefficient: -; Operating Temperature: -55°C ~ 155°C; Package / Case: 0603 (1608 Metric); Supplier Device Package: 0603; Size / Dimension: 0.063" L x 0.031" W (1.60mm x 0.80mm); Height: 0.022" (0.55mm); Number of Terminations: 2; ComponentLink1URL: http://industrial.panasonic.com/www-cgi/jvcr13pz.cgi?E+PZ+3+AOA0001+ERJ3GEY0R00V+7+WW; ComponentLink1Description: http://industrial.panasonic.com/www-cgi/jvcr13pz.cgi?E+PZ+3+AOA0001+ERJ3GEY0R00V+7+WW; Supplier Part Number 1: P0.0GCT-ND